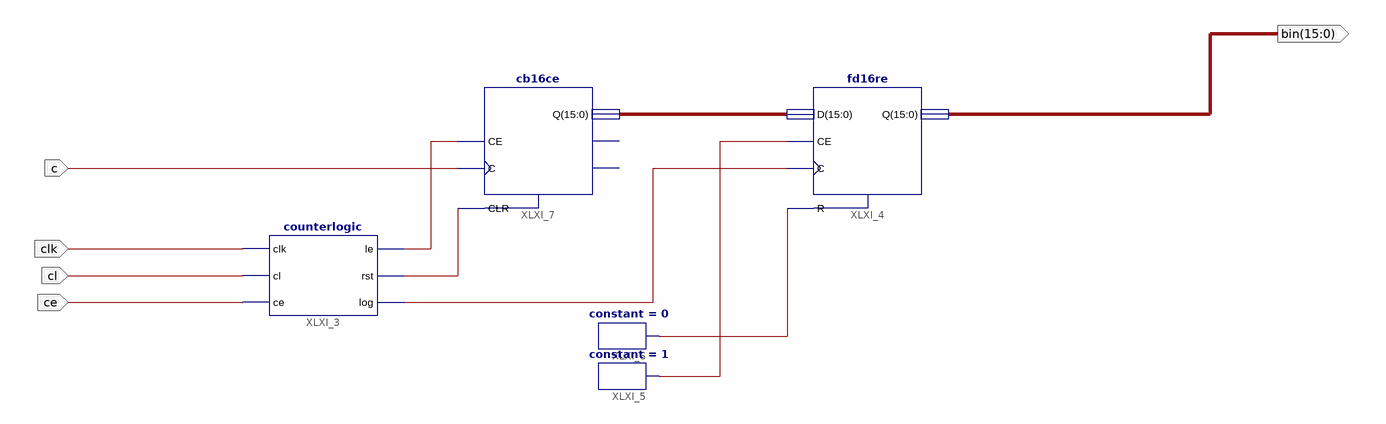
[diagram p0: schematic sheet 1]
// Xilinx ISE schematic countermodule.sch (spartan3e) as structural Verilog: 5 symbols, 5 ports
module countermodule (
  input  ce,
  input  c,
  input  clk,
  input  cl,
  output [15:0] bin
);

  wire XLXN_10, XLXN_11, XLXN_12, XLXN_13, XLXN_14;
  wire [15:0] XLXN_15;

  counterlogic XLXI_3 (.clk(clk), .cl(cl), .ce(ce), .le(XLXN_10), .rst(XLXN_11), .log(XLXN_12));
  fd16re XLXI_4 (.C(XLXN_12), .CE(XLXN_14), .D(XLXN_15), .R(XLXN_13), .Q(bin));
  constant #(.CValue("1")) XLXI_5 (.O(XLXN_14));
  constant #(.CValue("0")) XLXI_6 (.O(XLXN_13));
  cb16ce XLXI_7 (.C(c), .CE(XLXN_10), .CLR(XLXN_11), .Q(XLXN_15));  // open: CEO, TC
endmodule
